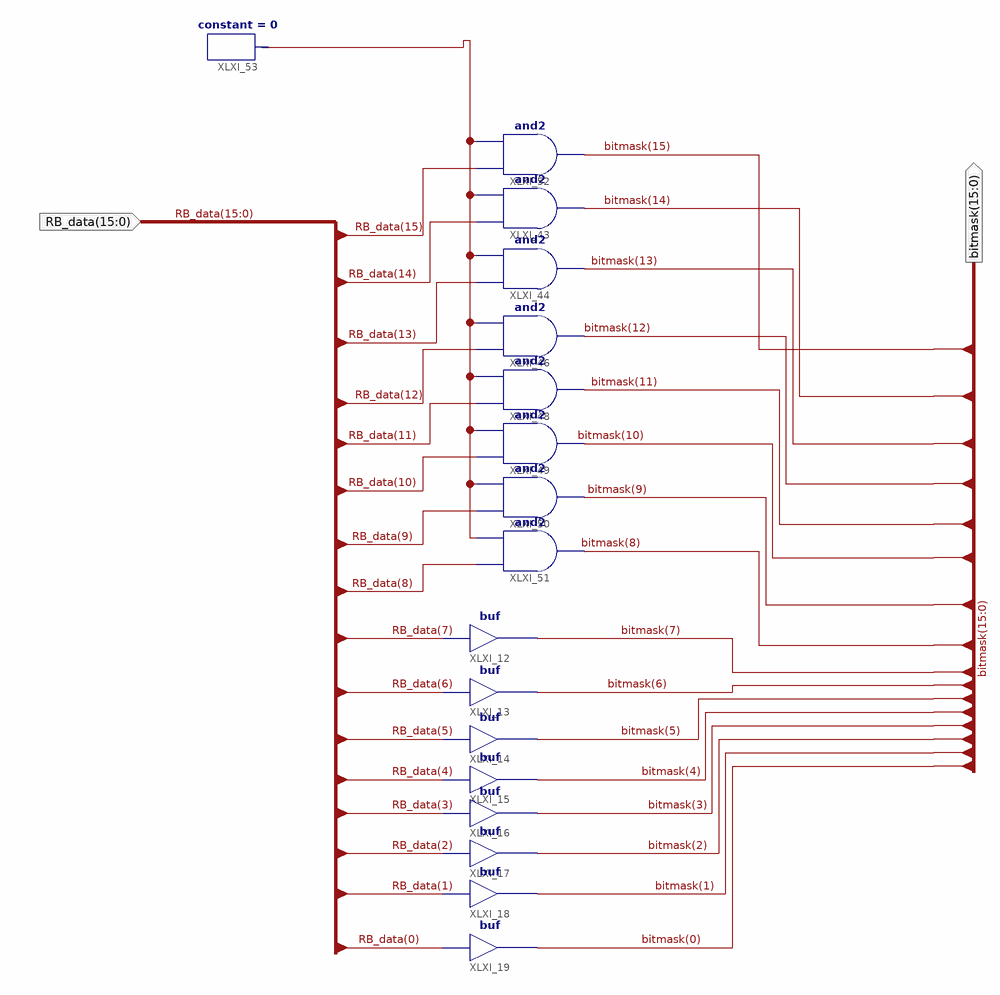
[diagram p0: schematic sheet 1]
// Xilinx ISE schematic bitmask.sch (spartan3e) as structural Verilog: 17 symbols, 2 ports
module bitmask (
  input  [15:0] RB_data,
  output [15:0] bitmask
);

  wire XLXN_34;

  buf XLXI_12 (bitmask[7], RB_data[7]);
  buf XLXI_13 (bitmask[6], RB_data[6]);
  buf XLXI_14 (bitmask[5], RB_data[5]);
  buf XLXI_15 (bitmask[4], RB_data[4]);
  buf XLXI_16 (bitmask[3], RB_data[3]);
  buf XLXI_17 (bitmask[2], RB_data[2]);
  buf XLXI_18 (bitmask[1], RB_data[1]);
  buf XLXI_19 (bitmask[0], RB_data[0]);
  and XLXI_43 (bitmask[14], RB_data[14], XLXN_34);
  and XLXI_44 (bitmask[13], RB_data[13], XLXN_34);
  and XLXI_46 (bitmask[12], RB_data[12], XLXN_34);
  and XLXI_48 (bitmask[11], RB_data[11], XLXN_34);
  and XLXI_49 (bitmask[10], RB_data[10], XLXN_34);
  and XLXI_50 (bitmask[9], RB_data[9], XLXN_34);
  and XLXI_51 (bitmask[8], RB_data[8], XLXN_34);
  and XLXI_52 (bitmask[15], RB_data[15], XLXN_34);
  constant #(.CValue("0")) XLXI_53 (.O(XLXN_34));
endmodule
